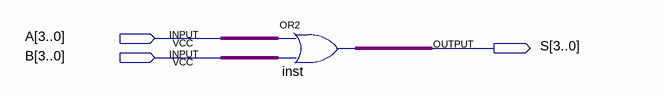
[diagram p0: schematic sheet]
// Quartus schematic OR4BIT.bdf as structural Verilog: 1 symbols, 3 pins
module OR4BIT (
  input  [3:0] A,
  input  [3:0] B,
  output [3:0] S
);

  assign S = A | B;  // OR2 inst, 4 bits wide
endmodule
